# Altium schematic sheet Power_Budget.SchDoc
size A3 portrait; SheetNumber: 10; SheetTotal: 10
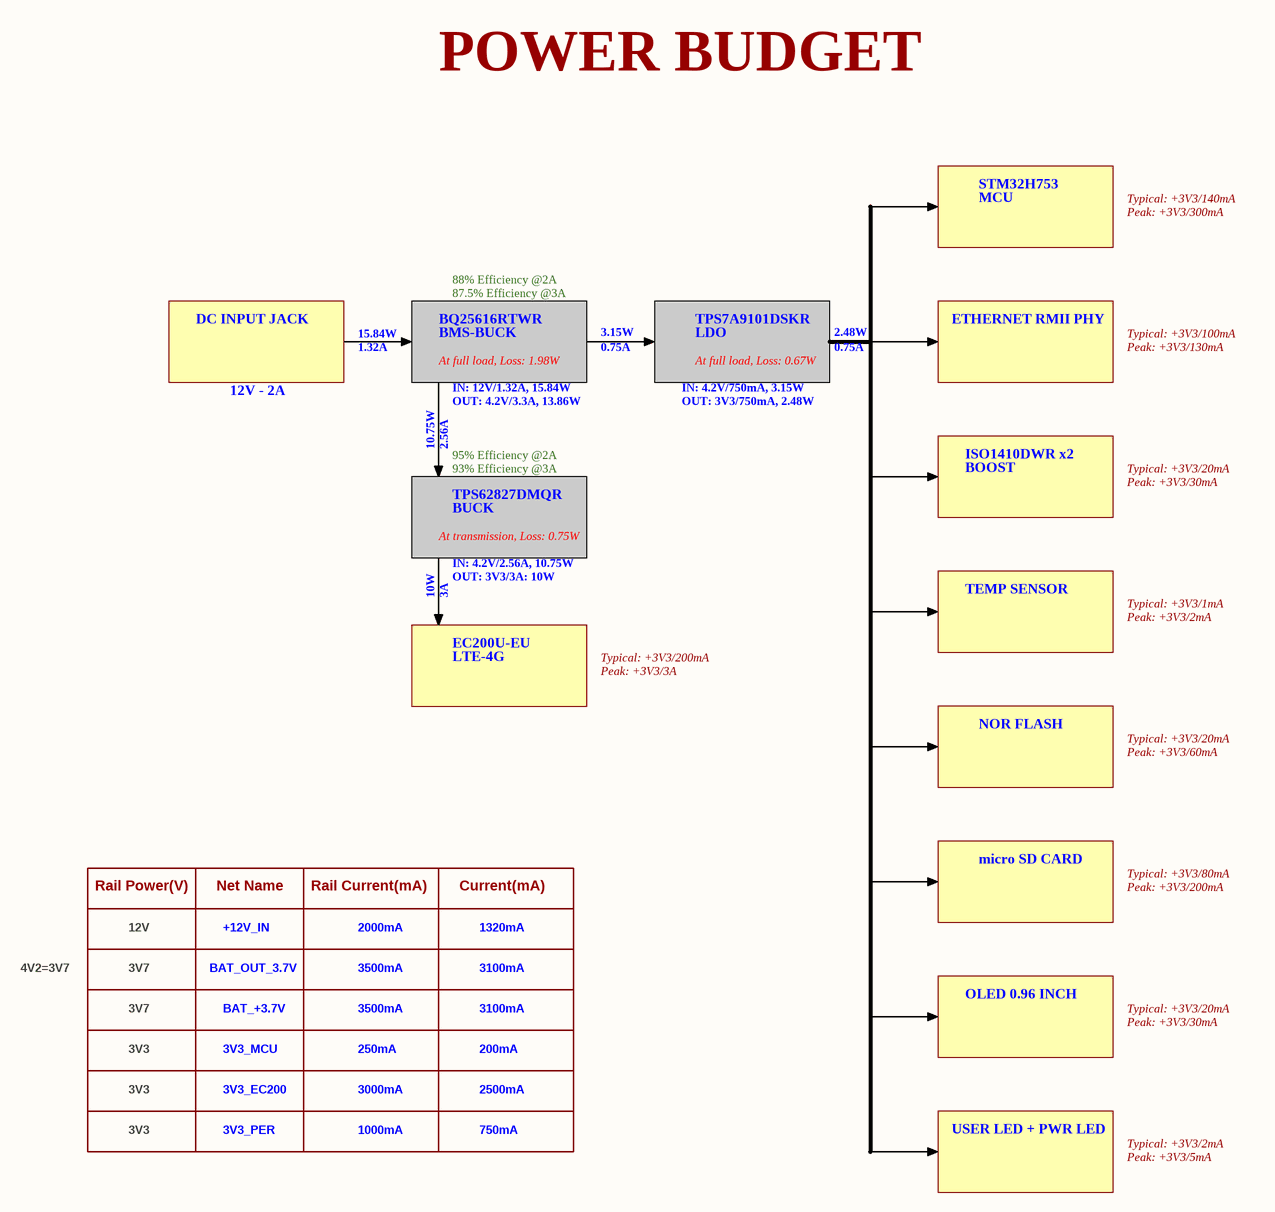
[diagram p0: Power_Budget.SchDoc]

## Notes on the sheet
- POWER BUDGET
- STM32H753
- MCU
- Typical: +3V3/140mA
- Peak: +3V3/300mA
- 88% Efficiency @2A
- DC INPUT JACK
- 15.84W
- 1.32A
- BQ25616RTWR
- BMS-BUCK
- 87.5% Efficiency @3A
- 3.15W
- 0.75A
- TPS7A9101DSKR
- LDO
- 2.48W
- ETHERNET RMII PHY
- Typical: +3V3/100mA
- Peak: +3V3/130mA
- 12V - 2A
- At full load, Loss: 1.98W
- IN: 12V/1.32A, 15.84W
- OUT: 4.2V/3.3A, 13.86W
- OUT: 3V3/750mA, 2.48W
- IN: 4.2V/750mA, 3.15W
- At full load, Loss: 0.67W
- 10.75W
- 2.56A
- 93% Efficiency @3A
- 95% Efficiency @2A
- ISO1410DWR x2
- BOOST
- Typical: +3V3/20mA
- Peak: +3V3/30mA
- At transmission, Loss: 0.75W
- TPS62827DMQR
- BUCK
- 10W
- OUT: 3V3/3A: 10W
- IN: 4.2V/2.56A, 10.75W
- 3A
- TEMP SENSOR
- Typical: +3V3/1mA
- Peak: +3V3/2mA
- EC200U-EU
- LTE-4G
- Typical: +3V3/200mA
- Peak: +3V3/3A
- NOR FLASH
- Peak: +3V3/60mA
- Rail Power(V)
- Net Name
- Rail Current(mA)
- Current(mA)
- micro SD CARD
- Typical: +3V3/80mA
- Peak: +3V3/200mA
- 12V
- +12V_IN
- 2000mA
- 1320mA
- 4V2=3V7
- 3V7
- BAT_OUT_3.7V
- BAT_+3.7V
- 3500mA
- 3100mA
- OLED 0.96 INCH
- 3V3
- 3V3_MCU
- 3V3_EC200
- 250mA
- 3000mA
- 200mA
- 2500mA
- 3V3_PER
- 1000mA
- 750mA
- USER LED + PWR LED
- Typical: +3V3/2mA
- Peak: +3V3/5mA